# EAGLE schematic untitled (EAGLE 9.6.2)
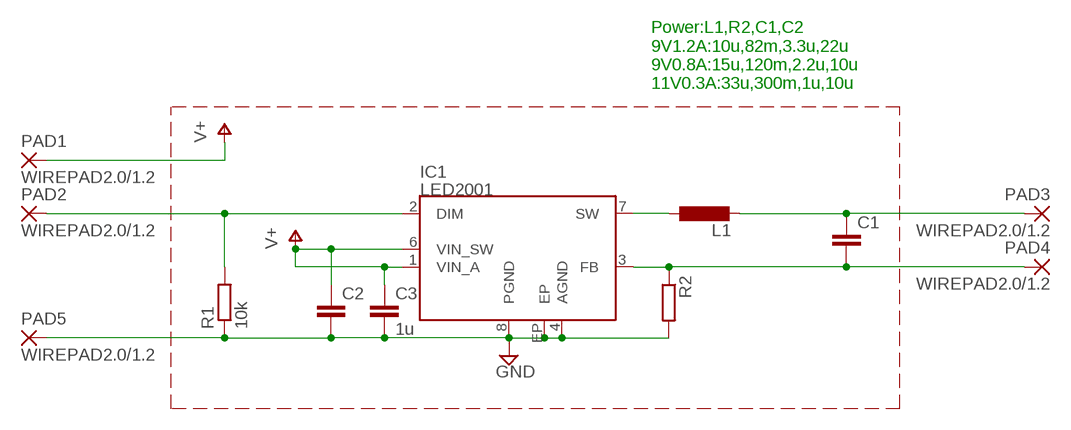
[diagram p0: schematic, sheet 1]

## Parts
C1  C-EUC1210  [C1210]
C2  C-EUC0805  [C0805]
C3  1u  C-EUC0603  [C0603]
IC1  LED2001  [HSOP8]
L1  L-EUL8080  [L8080]
PAD1  WIREPAD2.0/1.2  [2.0/1.3]
PAD2  WIREPAD2.0/1.2  [2.0/1.3]
PAD3  WIREPAD2.0/1.2  [2.0/1.3]
PAD4  WIREPAD2.0/1.2  [2.0/1.3]
PAD5  WIREPAD2.0/1.2  [2.0/1.3]
R1  10k  R-EU_R0402  [R0402]
R2  R-EU_R1210  [R1210]

## Nets
GND: C2.2 C3.2 IC1.4(AGND) IC1.8(PGND) IC1.EP PAD5.1(P) R1.1 R2.2
N$1: IC1.7(SW) L1.1
N$6: C1.1 L1.2 PAD3.1(P)
N$13: C1.2 IC1.3(FB) PAD4.1(P) R2.1
N$15: IC1.2(DIM) PAD2.1(P) R1.2
V+: C2.1 C3.1 IC1.1(VIN_A) IC1.6(VIN_SW) PAD1.1(P)

## Notes on the sheet
- Power:L1,R2,C1,C2
  9V1.2A:10u,82m,3.3u,22u
  9V0.8A:15u,120m,2.2u,10u
  11V0.3A:33u,300m,1u,10u

## Library data of the parts
C1-C3 = rcl:C-EU: CAPACITOR, European symbol; SPICEPREFIX: C
IC1 = 0 my parts:LED2001
L1 = 2 RCL:L-EU: INDUCTOR, European symbol
PAD1-PAD5 = 4 PAD:WIREPAD: Wire PAD connect wire on PCB
R1 R2 = rcl:R-EU_: RESISTOR, European symbol; SPICEPREFIX: R